# Altium schematic sheet LPCB235 - PUSHER INTERLOCK.SchDoc
size A3; Address1: Factory 10; Address2: 9-13 Dingley Avenue, Dandeong, VICTORIA 3175, AUSTRALIA; DocumentNumber: 20; Revision: 1; SheetNumber: 20; SheetTotal: 37; Lockie__PCB_SUB_ASSEMBLY: Pusher Interlock; Lockie__PCB_ASSEMBLY: FCU PCB; Lockie__LDL: LPCB235; Lockie__PCB_DESCRIPTION: Flight Control Unit
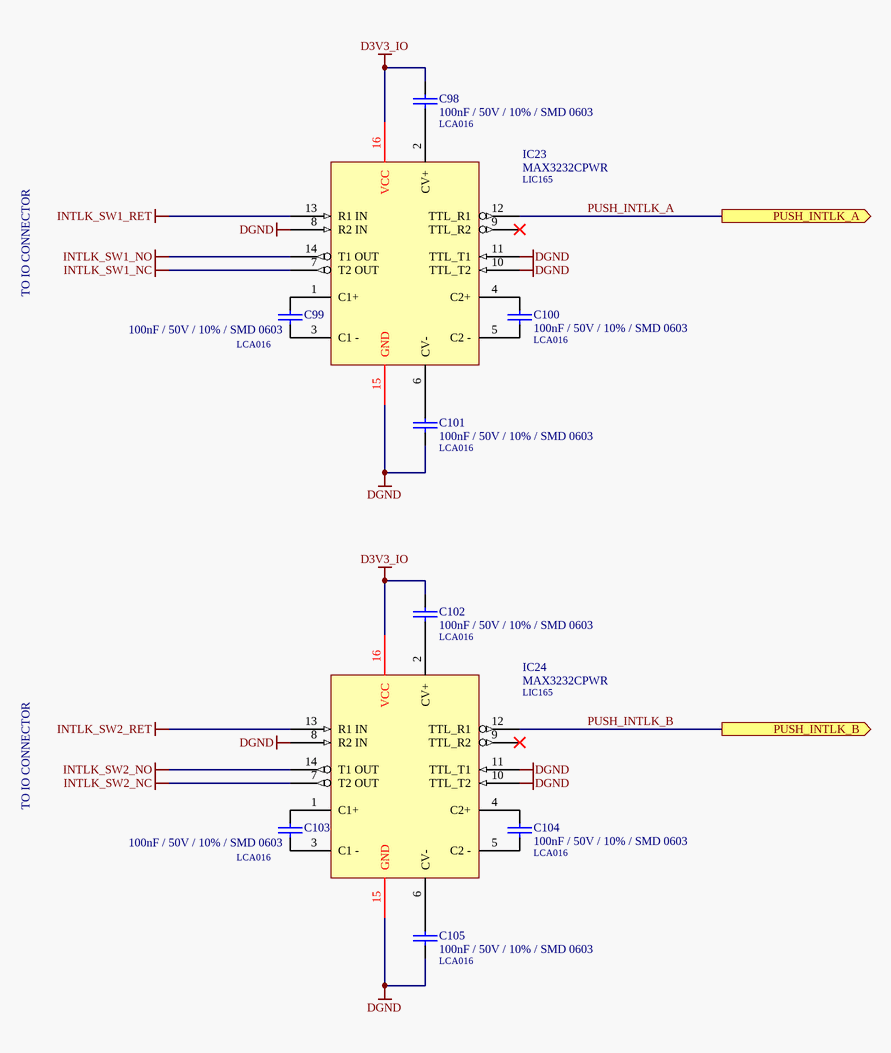
[diagram p0: LPCB235 - PUSHER INTERLOCK.SchDoc]

## Parts
C98  100nF / 50V / 10% / SMD 0603  LDL_NUMBER: LCA016  [LFP011__CC1608-0603-IPC7351_B]
C99  100nF / 50V / 10% / SMD 0603  LDL_NUMBER: LCA016  [LFP011__CC1608-0603-IPC7351_B]
C100  100nF / 50V / 10% / SMD 0603  LDL_NUMBER: LCA016  [LFP011__CC1608-0603-IPC7351_B]
C101  100nF / 50V / 10% / SMD 0603  LDL_NUMBER: LCA016  [LFP011__CC1608-0603-IPC7351_B]
C102  100nF / 50V / 10% / SMD 0603  LDL_NUMBER: LCA016  [LFP011__CC1608-0603-IPC7351_B]
C103  100nF / 50V / 10% / SMD 0603  LDL_NUMBER: LCA016  [LFP011__CC1608-0603-IPC7351_B]
C104  100nF / 50V / 10% / SMD 0603  LDL_NUMBER: LCA016  [LFP011__CC1608-0603-IPC7351_B]
C105  100nF / 50V / 10% / SMD 0603  LDL_NUMBER: LCA016  [LFP011__CC1608-0603-IPC7351_B]
IC23  MAX3232CPWR  LDL_NUMBER: LIC165  [LFP049__TSSOP-16]
IC24  MAX3232CPWR  LDL_NUMBER: LIC165  [LFP049__TSSOP-16]

## Ports
PUSH_INTLK_A (out), PUSH_INTLK_B (out)

## Nets
D3V3_IO: C98.1 C102.1 IC23.16(VCC) IC24.16(VCC)
DGND: C101.2 C105.2 IC23.8(R2_IN) IC23.10(TTL_T2) IC23.11(TTL_T1) IC23.15(GND) IC24.8(R2_IN) IC24.10(TTL_T2) IC24.11(TTL_T1) IC24.15(GND)
INTLK_SW1_NC: IC23.7(T2_OUT)
INTLK_SW1_NO: IC23.14(T1_OUT)
INTLK_SW1_RET: IC23.13(R1_IN)
INTLK_SW2_NC: IC24.7(T2_OUT)
INTLK_SW2_NO: IC24.14(T1_OUT)
INTLK_SW2_RET: IC24.13(R1_IN)
PUSH_INTLK_A: IC23.12(TTL_R1) ; port PUSH_INTLK_A
PUSH_INTLK_B: IC24.12(TTL_R1) ; port PUSH_INTLK_B
NetC98_2: C98.2 IC23.2(CV+)
NetC99_1: C99.1 IC23.1(C1+)
NetC99_2: C99.2 IC23.3(C1_-)
NetC100_1: C100.1 IC23.4(C2+)
NetC100_2: C100.2 IC23.5(C2_-)
NetC101_1: C101.1 IC23.6(CV-)
NetC102_2: C102.2 IC24.2(CV+)
NetC103_1: C103.1 IC24.1(C1+)
NetC103_2: C103.2 IC24.3(C1_-)
NetC104_1: C104.1 IC24.4(C2+)
NetC104_2: C104.2 IC24.5(C2_-)
NetC105_1: C105.1 IC24.6(CV-)

Not connected (* = marked no-connect by the designer): IC23 9(TTL_R2)*; IC24 9(TTL_R2)*

## Notes on the sheet
- TO IO CONNECTOR
- PCB COMPONENT DESCRIPTION
- LDL NUMBER
- Assembly Details
- Size
- Drawing File Name
- Revision
- http://rloop.org
- Scale
- A3
- Sheet Details
- N.T.S
- Sheet:
- Of:

## Library data of the parts
C98-C105 = 100nF / 50V / 10% / SMD 0603: Capacitor, Ceramic Chip, 100nF (0.1uF), 50V, 5%, SMD 0603 [LCA016]; Value: 100n; FMEDA__OPERATING__VOLTAGE_MIN: 0; FMEDA__OPERATING__VOLTAGE_MAX: 3.3; FMEDA__OPERATING__TEMP_MIN: -20; FMEDA__OPERATING__TEMP_TYP: 27; FMEDA__OPERATING__TEMP_MAX: 50; FMEDA__CHANNEL: COM; FMEDA__FUNCTION_IN_SYSTEM: *; FMEDA__OPERATING__VOLTAGE_TYP: 3.3
IC23 IC24 = MAX3232CPWR: IC, RS232 Line Driver, 3.3V, SMD TSSOP16 [LIC165]; FMEDA__OPERATING__TEMP_MAX: 50; FMEDA__OPERATING__TEMP_MIN: -20; FMEDA__OPERATING__TEMP_TYP: 27; FMEDA__CHANNEL: COM; FMEDA__OPERATING__VOLTAGE_MAX: 3.3; FMEDA__OPERATING__VOLTAGE_MIN: 0; FMEDA__FUNCTION_IN_SYSTEM: *; FMEDA__OPERATING__VOLTAGE_TYP: 3.3